# Altium schematic sheet 相位.SchDoc
size A4; PageSetup: Record=PageOptions|CenterHorizontal=True|CenterVertical=True|PrintScale=0.97|XCorrection=1.00|YCorrection=1.00|PrintKind=1|BorderSize=5000000|LeftOffset=0|BottomOffset=0|Orientation=2|PaperLength=1000|PaperWidth=1000|Scale=100|PaperSource=15|PrintQuality=600|MediaType=1|DitherType=10|PaperKind=A3|PrintScaleMode=1
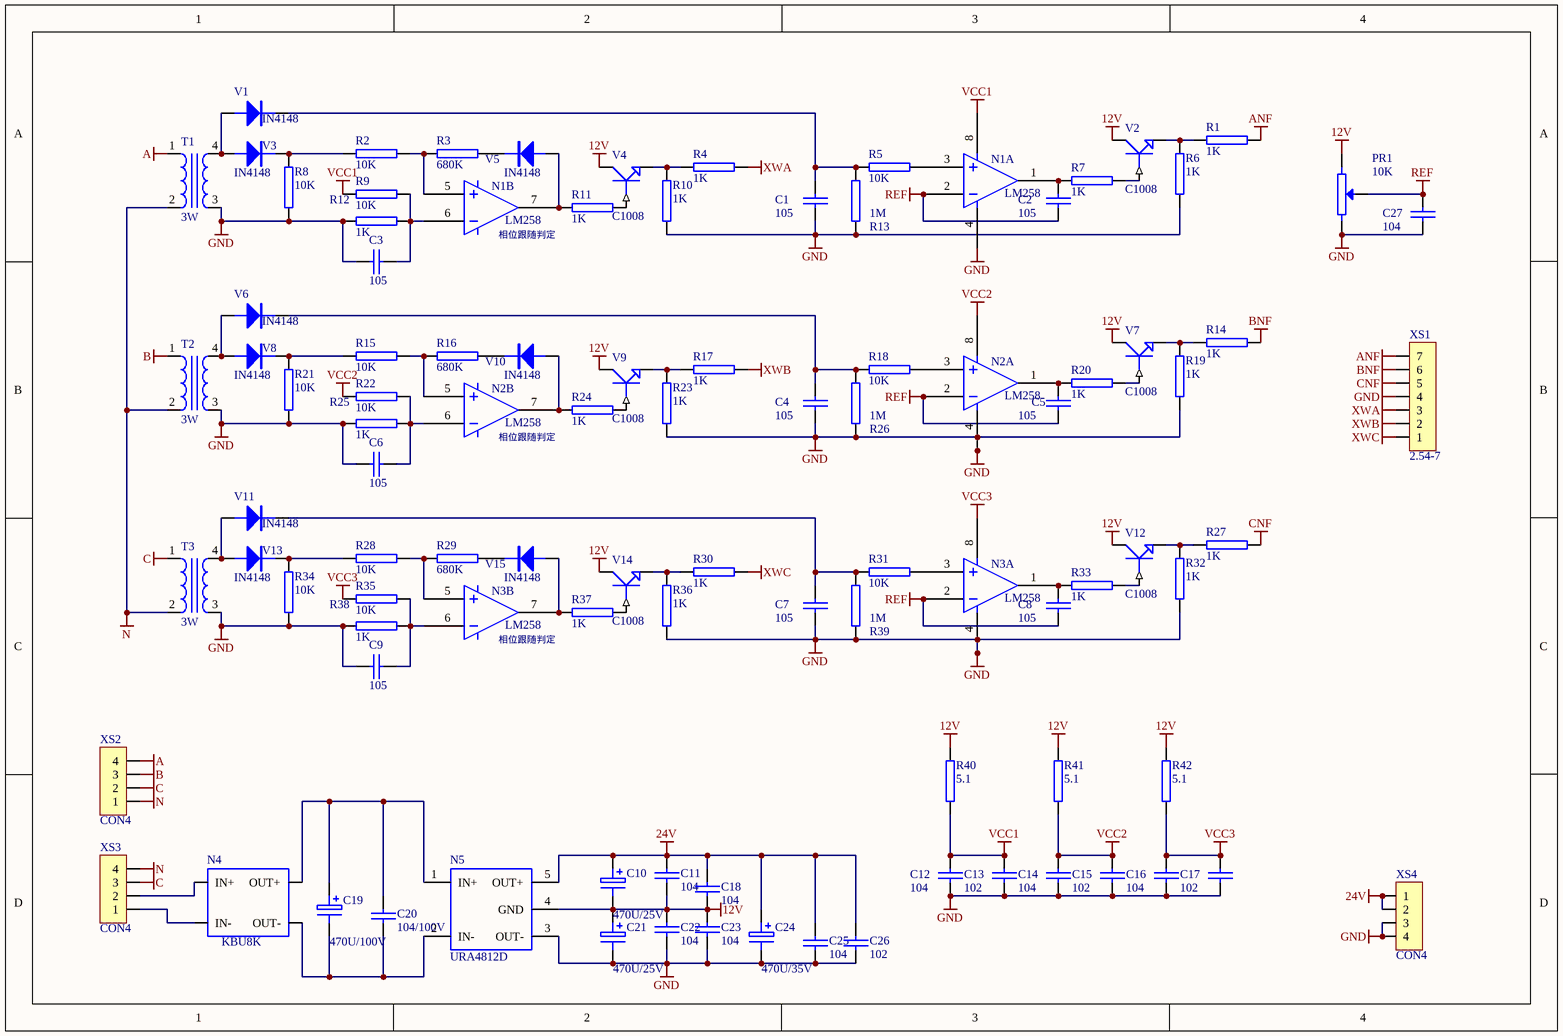
[diagram p0: 相位.SchDoc]

## Parts
C1  105  [0805A]
C2  105  [0805A]
C3  105  [0805A]
C4  105  [0805A]
C5  105  [0805A]
C6  105  [0805A]
C7  105  [0805A]
C8  105  [0805A]
C9  105  [0805A]
C10  470U/25V  [RB5/10]
C11  104  [1206]
C12  104  [0805A]
C13  102  [0805A]
C14  104  [0805A]
C15  102  [0805A]
C16  104  [0805A]
C17  102  [0805A]
C18  104  [1206]
C19  470U/100V  [RB.2/.6]
C20  104/100V  [RAD0.2]
C21  470U/25V  [RB5/10]
C22  104  [1206]
C23  104  [1206]
C24  470U/35V  [RB5/10]
C25  104  [1206]
C26  102  [1206]
C27  104  [0805A]
N1  LM258  [SO-8]  (parts A,B of 2)
N2  LM258  [SO-8]  (parts A,B of 2)
N3  LM258  [SO-8]  (parts A,B of 2)
N4  KBU8K
N5  URA4812D  [URA48]
PR1  10K  [3224]
R1  1K  [0805A]
R2  10K  [0805A]
R3  680K  [0805A]
R4  1K  [0805A]
R5  10K  [0805A]
R6  1K  [0805A]
R7  1K  [0805A]
R8  10K  [0805A]
R9  10K  [0805A]
R10  1K  [0805A]
R11  1K  [0805A]
R12  1K  [0805A]
R13  1M  [0805A]
R14  1K  [0805A]
R15  10K  [0805A]
R16  680K  [0805A]
R17  1K  [0805A]
R18  10K  [0805A]
R19  1K  [0805A]
R20  1K  [0805A]
R21  10K  [0805A]
R22  10K  [0805A]
R23  1K  [0805A]
R24  1K  [0805A]
R25  1K  [0805A]
R26  1M  [0805A]
R27  1K  [0805A]
R28  10K  [0805A]
R29  680K  [0805A]
R30  1K  [0805A]
R31  10K  [0805A]
R32  1K  [0805A]
R33  1K  [0805A]
R34  10K  [0805A]
R35  10K  [0805A]
R36  1K  [0805A]
R37  1K  [0805A]
R38  1K  [0805A]
R39  1M  [0805A]
R40  5.1  [0805A]
R41  5.1  [0805A]
R42  5.1  [0805A]
T1  3W  [EE35]
T2  3W  [EE35]
T3  3W  [EE35]
V1  IN4148  [1206-D]
V2  C1008  [SOT-23]
V3  IN4148  [1206-D]
V4  C1008  [SOT-23]
V5  IN4148  [1206-D]
V6  IN4148  [1206-D]
V7  C1008  [SOT-23]
V8  IN4148  [1206-D]
V9  C1008  [SOT-23]
V10  IN4148  [1206-D]
V11  IN4148  [1206-D]
V12  C1008  [SOT-23]
V13  IN4148  [1206-D]
V14  C1008  [SOT-23]
V15  IN4148  [1206-D]
XS1  2.54-7  [SIP7]
XS2  CON4  [XS10A-4P]
XS3  CON4  [XS10A-4P]
XS4  CON4  [SIP4]

## Nets
12V: C10.2 C11.2 C18.2 C21.1 C22.1 C23.1 N5.4(GND) PR1.2 R40.2 R41.2 R42.2 V2.C V4.C V7.C V9.C V12.C V14.C
24V: C10.1 C11.1 C18.1 C24.1 C25.1 C26.1 N5.5(OUT+) XS4.1 XS4.2
A: T1.1 XS2.4
ANF: R1.2 XS1.7
B: T2.1 XS2.3
BNF: R14.2 XS1.6
C: T3.1 XS2.2 XS3.3
CNF: R27.2 XS1.5
GND: C1.1 C3.2 C4.1 C6.2 C7.1 C9.2 C12.1 C13.1 C14.1 C15.1 C16.1 C17.1 C21.2 C22.2 C23.2 C24.2 C25.2 C26.2 C27.1 N1.4 N2.4 N3.4 N5.3(OUT-) PR1.1 R6.1 R8.1 R10.1 R12.1 R13.2 R19.1 R21.1 R23.1 R25.1 R26.2 R32.1 R34.1 R36.1 R38.1 R39.2 T1.3 T2.3 T3.3 XS1.4 XS4.3 XS4.4
N: T1.2 T2.2 T3.2 XS2.1 XS3.4
REF: C2.1 C5.1 C8.1 C27.2 N1.2 N2.2 N3.2 PR1.W
VCC1: C12.2 C13.2 N1.8 R9.1 R40.1
VCC2: C14.2 C15.2 N2.8 R22.1 R41.1
VCC3: C16.2 C17.2 N3.8 R35.1 R42.1
XWA: R4.2 XS1.3
XWB: R17.2 XS1.2
XWC: R30.2 XS1.1
NetC1_2: C1.2 R5.1 R13.1 V1.K
NetC2_2: C2.2 N1.1 R7.1
NetC3_1: C3.1 N1.6 R9.2 R12.2
NetC4_2: C4.2 R18.1 R26.1 V6.K
NetC5_2: C5.2 N2.1 R20.1
NetC6_1: C6.1 N2.6 R22.2 R25.2
NetC7_2: C7.2 R31.1 R39.1 V11.K
NetC8_2: C8.2 N3.1 R33.1
NetC9_1: C9.1 N3.6 R35.2 R38.2
NetC19_1: C19.1 C20.1 N4.OUT+ N5.1(IN+)
NetC19_2: C19.2 C20.2 N4.OUT- N5.2(IN-)
NetN1_3: N1.3 R5.2
NetN1_5: N1.5 R2.2 R3.2
NetN1_7: N1.7 R11.1 V5.A
NetN2_3: N2.3 R18.2
NetN2_5: N2.5 R15.2 R16.2
NetN2_7: N2.7 R24.1 V10.A
NetN3_3: N3.3 R31.2
NetN3_5: N3.5 R28.2 R29.2
NetN3_7: N3.7 R37.1 V15.A
NetN4_IN+: N4.IN+ XS3.2
NetN4_IN-: N4.IN- XS3.1
NetR1_1: R1.1 R6.2 V2.E
NetR2_1: R2.1 R8.2 V3.K
NetR3_1: R3.1 V5.K
NetR4_1: R4.1 R10.2 V4.E
NetR7_2: R7.2 V2.B
NetR11_2: R11.2 V4.B
NetR14_1: R14.1 R19.2 V7.E
NetR15_1: R15.1 R21.2 V8.K
NetR16_1: R16.1 V10.K
NetR17_1: R17.1 R23.2 V9.E
NetR20_2: R20.2 V7.B
NetR24_2: R24.2 V9.B
NetR27_1: R27.1 R32.2 V12.E
NetR28_1: R28.1 R34.2 V13.K
NetR29_1: R29.1 V15.K
NetR30_1: R30.1 R36.2 V14.E
NetR33_2: R33.2 V12.B
NetR37_2: R37.2 V14.B
NetT1_4: T1.4 V1.A V3.A
NetT2_4: T2.4 V6.A V8.A
NetT3_4: T3.4 V11.A V13.A

## Notes on the sheet
- (near N1) 相位跟随判定
- (near N2) 相位跟随判定
- (near N3) 相位跟随判定

## Library data of the parts
C1-C9 C11-C18 C20 C22 C23 C25-C27 = CAP
C10 C19 C21 C24 = ELECTRO1
N1-N3 = LF353
N4 = DC-DC
N5 = YND5
PR1 = POT
R1-R42 = RES2
T1-T3 = TRANS1
V1 V3 V5 V6 V8 V10 V11 V13 V15 = DIODE1
V2 V4 V7 V9 V12 V14 = NPN1
XS1 = CON7